# EAGLE schematic circuit (EAGLE 7.3.0)
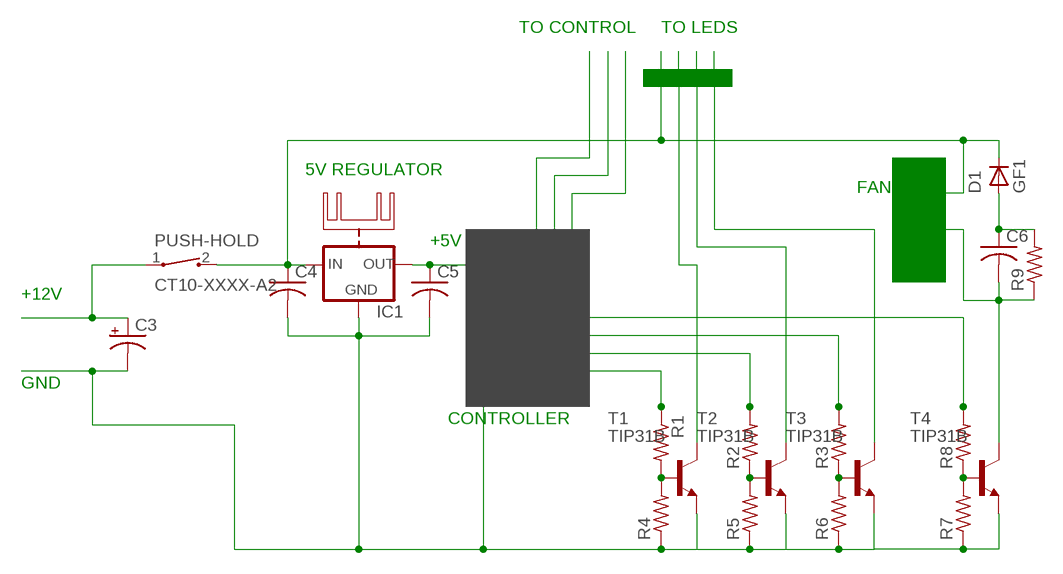
[diagram p0: schematic, sheet 1]

## Parts
C3  CPOL-US150CLZ-0810  [150CLZ-0810]
C4  C-USC1812  [C1812]
C5  C-USC1812  [C1812]
C6  C-USC1812  [C1812]
D1  GF1  [SMA-DO214AC]
IC1  78XXH  [78XXH]
PUSH-HOLD  CT10-XXXX-A2  [CT10-XXXX-A2]
R1  R-US_0207/10  [0207/10]
R2  R-US_0207/10  [0207/10]
R3  R-US_0207/10  [0207/10]
R4  R-US_0207/10  [0207/10]
R5  R-US_0207/10  [0207/10]
R6  R-US_0207/10  [0207/10]
R7  R-US_0207/12  [0207/12]
R8  R-US_0207/12  [0207/12]
R9  R-US_0309/10  [0309/10]
T1  TIP31B  [TO220]
T2  TIP31B  [TO220]
T3  TIP31B  [TO220]
T4  TIP31B  [TO220]

## Nets
N$1: C3.+ PUSH-HOLD.1
N$2: C3.- C4.2 C5.2 IC1.GND R4.1 R5.1 R6.1 R7.1 T1.3(E) T2.3(E) T3.3(E) T4.3(E)
N$3: C4.1 D1.K(C) IC1.IN PUSH-HOLD.2
N$4: T1.2(C)
N$5: T2.2(C)
N$6: T3.2(C)
N$11: C5.1 IC1.OUT
N$12: R1.1
N$13: R3.1 R6.2 T3.1(B)
N$15: R2.1 R5.2 T2.1(B)
N$18: R1.2 R4.2 T1.1(B)
N$19: R2.2
N$20: R3.2
N$21: C6.2 R9.1 T4.2(C)
N$22: R8.2
N$23: R7.2 R8.1 T4.1(B)
N$25: C6.1 D1.A R9.2

## Notes on the sheet
- TO CONTROL | TO LEDS
- 5V REGULATOR
- FAN
- +5V | CTRL
- VIN
- +12V
- FAN
- G
  R
  B
- GND | GND
- CONTROLLER

## Library data of the parts
C3 = rcl:CPOL-US: POLARIZED CAPACITOR, American symbol
C4-C6 = rcl:C-US: CAPACITOR, American symbol
D1 = diode:GF1: DIODE
IC1 = 78xx_with_heatsink:78XXH: VOLTAGE REGULATOR
PUSH-HOLD = switch-coto:CT10-XXXX-: CT10 Series Molded Switch Source: www.cotorelay.com .. Coto_Technology__CT10-1530-G1.pdf
R1-R9 = rcl:R-US_: RESISTOR, American symbol
T1-T4 = transistor:TIP31: NPN Transistor Medium Power Linear Switching Applications Source: http://onsemi.com